# EAGLE design adc_guarded_newinput_autorouted (EAGLE 5.07)
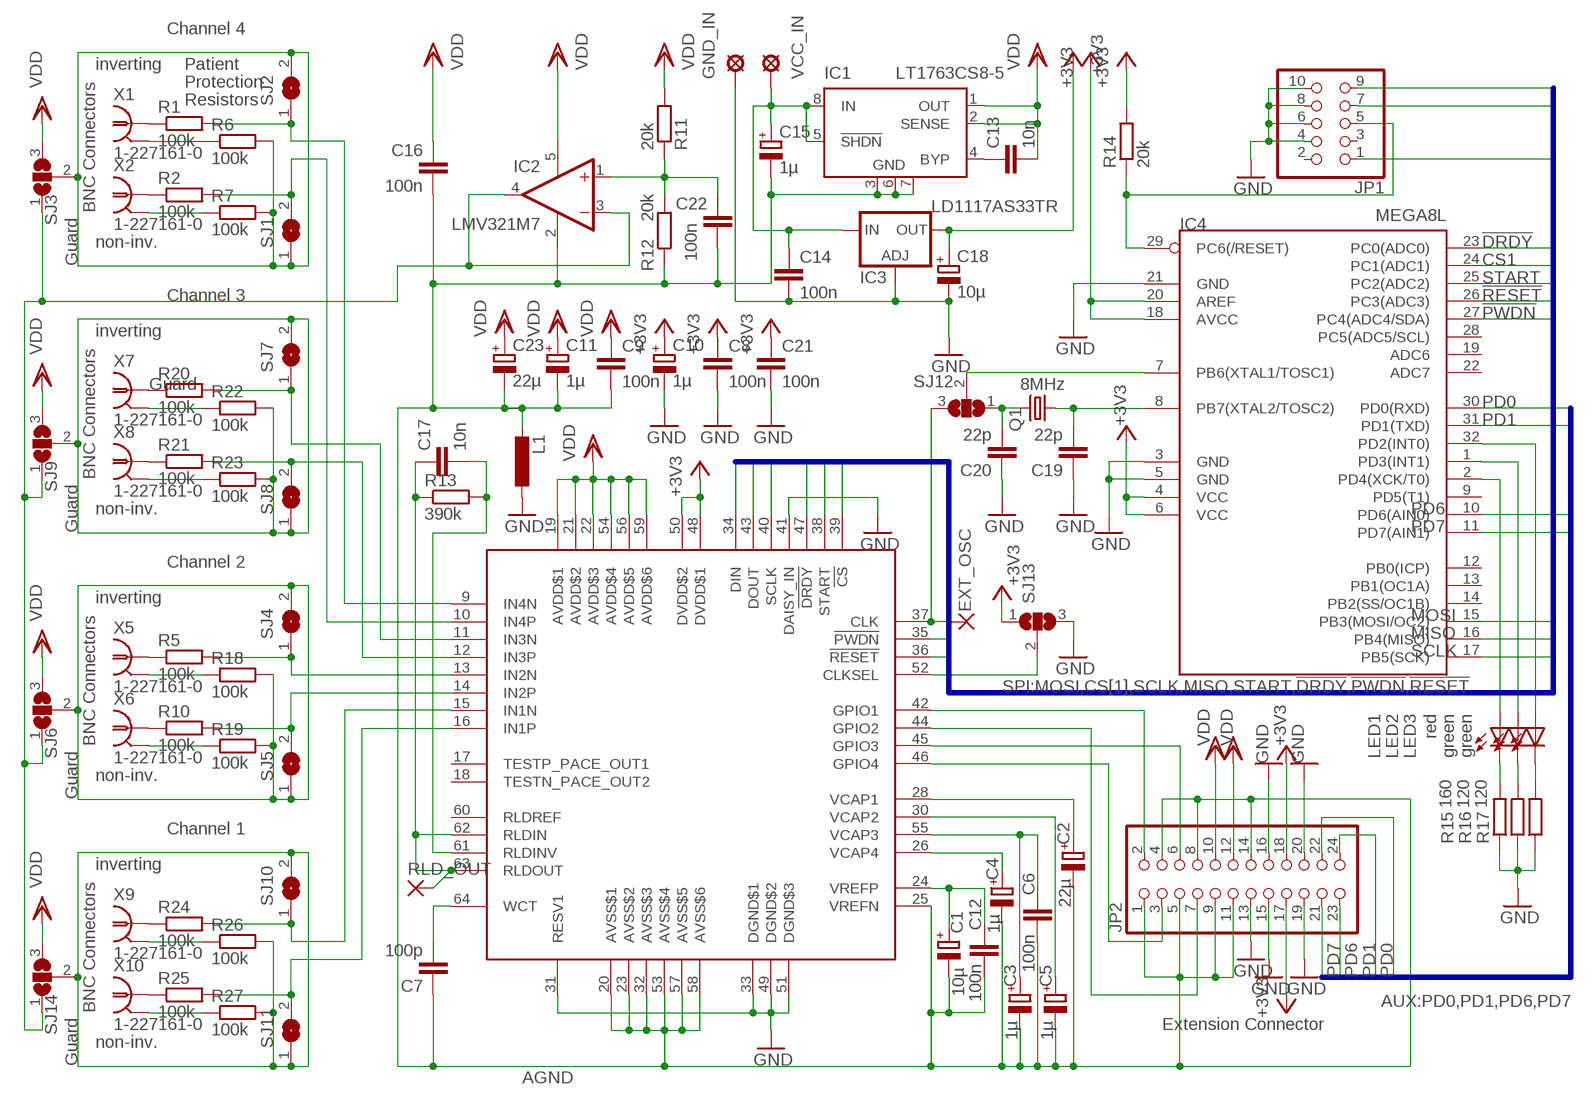
[diagram p0: schematic, sheet 1]

## Parts
C1  10µ  CPOL-EUSMCC  [SMC_C]
C2  22µ  CPOL-EUSMCD  [SMC_D]
C3  1µ  CPOL-EUSMCA  [SMC_A]
C4  1µ  CPOL-EUSMCA  [SMC_A]
C5  1µ  CPOL-EUSMCA  [SMC_A]
C6  100n  C-EUC1206  [C1206]
C7  100p  C-EUC1206  [C1206]
C8  100n  C-EUC1206  [C1206]
C9  100n  C-EUC1206  [C1206]
C10  1µ  CPOL-EUSMCA  [SMC_A]
C11  1µ  CPOL-EUSMCA  [SMC_A]
C12  100n  C-EUC1206  [C1206]
C13  10n  C-EUC1206  [C1206]
C14  100n  C-EUC1206  [C1206]
C15  1µ  CPOL-EUSMCA  [SMC_A]
C16  100n  C-EUC1206  [C1206]
C17  10n  C-EUC1206  [C1206]
C18  10µ  CPOL-EUSMCC  [SMC_C]
C19  22p  C-EUC1206  [C1206]
C20  22p  C-EUC1206  [C1206]
C21  100n  C-EUC1206  [C1206]
C22  100n  C-EUC1206  [C1206]
C23  22µ  CPOL-EUSMCD  [SMC_D]
EXT_OSC  1,6/0,8  [1,6/0,8]
GND_IN  MCS10B  [MCS10B]
IC1  LT1763CS8-5  LT1763CS8-3.3  [SOIC8]
IC2  LMV321M7  [SC70-5L]
IC3  LD1117AS33TR  LD117AS33TR  [SOT223]
IC4  MEGA8L  MEGA8-AI  [TQFP32-08]
JP1  PINHD-2X5  [2X05]
JP2  PINHD-2X12  [2X12]
L1  L-EUPIS2816  [PIS2816]
LED1  red  LEDCHIPLED_1206  [CHIPLED_1206]
LED2  green  LEDCHIPLED_1206  [CHIPLED_1206]
LED3  green  LEDCHIPLED_1206  [CHIPLED_1206]
Q1  8MHz  CRYSTALHC49UP  [HC49UP]
R1  100k  R-EU_R1206  [R1206]
R2  100k  R-EU_R1206  [R1206]
R5  100k  R-EU_R1206  [R1206]
R6  100k  R-EU_R1206  [R1206]
R7  100k  R-EU_R1206  [R1206]
R10  100k  R-EU_R1206  [R1206]
R11  20k  R-EU_R1206  [R1206]
R12  20k  R-EU_R1206  [R1206]
R13  390k  R-EU_R1206  [R1206]
R14  20k  R-EU_R1206  [R1206]
R15  160  R-EU_R1206  [R1206]
R16  120  R-EU_R1206  [R1206]
R17  120  R-EU_R1206  [R1206]
R18  100k  R-EU_R1206  [R1206]
R19  100k  R-EU_R1206  [R1206]
R20  100k  R-EU_R1206  [R1206]
R21  100k  R-EU_R1206  [R1206]
R22  100k  R-EU_R1206  [R1206]
R23  100k  R-EU_R1206  [R1206]
R24  100k  R-EU_R1206  [R1206]
R25  100k  R-EU_R1206  [R1206]
R26  100k  R-EU_R1206  [R1206]
R27  100k  R-EU_R1206  [R1206]
RLD_OUT  2,54/1,0  [2,54/1,0]
SJ1  SJW  [SJW]
SJ2  SJW  [SJW]
SJ3  SJ2WW  [SJ_2W]
SJ4  SJW  [SJW]
SJ5  SJW  [SJW]
SJ6  SJ2WW  [SJ_2W]
SJ7  SJW  [SJW]
SJ8  SJW  [SJW]
SJ9  SJ2WW  [SJ_2W]
SJ10  SJW  [SJW]
SJ11  SJW  [SJW]
SJ12  SJ2W  [SJ_2]
SJ13  SJ2W  [SJ_2]
SJ14  SJ2WW  [SJ_2W]
U$1  ADS1194  [TQFP-64]
VCC_IN  MCS10B  [MCS10B]
X1  1-227161-0  [AMP_227161]
X2  1-227161-0  [AMP_227161]
X5  1-227161-0  [AMP_227161]
X6  1-227161-0  [AMP_227161]
X7  1-227161-0  [AMP_227161]
X8  1-227161-0  [AMP_227161]
X9  1-227161-0  [AMP_227161]
X10  1-227161-0  [AMP_227161]

## Nets
!DRDY: IC4.23(PC0(ADC0)) U$1.47(!DRDY)
!PWDN: IC4.27(PC4(ADC4/SDA)) U$1.35(!PWDN)
!RESET: IC4.26(PC3(ADC3)) U$1.36(!RESET)
+3V3: C8.1 C10.+ C18.+ C21.1 IC3.4(OUT) IC4.4(VCC) IC4.6(VCC) IC4.18(AVCC) IC4.20(AREF) JP2.17 JP2.18 R14.2 SJ13.1 U$1.48(DVDD$1) U$1.50(DVDD$2)
CS1: IC4.24(PC1(ADC1)) U$1.39(!CS)
GND: C8.2 C10.- C14.2 C18.- C19.1 C20.1 C21.2 GND_IN.MP IC3.1(ADJ) IC4.3(GND) IC4.5(GND) IC4.21(GND) JP1.4 JP1.6 JP1.8 JP1.10 JP2.13 JP2.15 JP2.16 JP2.19 JP2.20 L1.1 R15.1 R16.1 R17.1 SJ13.3 U$1.31(RESV1) U$1.33(DGND$1) U$1.41(DAISY_IN) U$1.49(DGND$2) U$1.51(DGND$3)
MISO: IC4.16(PB4(MISO)) JP1.9 U$1.43(DOUT)
MOSI: IC4.15(PB3(MOSI/OC2)) JP1.1 U$1.34(DIN)
N$1: C2.+ U$1.28(VCAP1)
N$2: C4.+ U$1.26(VCAP4)
N$3: C7.2 U$1.64(WCT)
N$4: C5.+ U$1.30(VCAP2)
N$5: C3.+ C6.1 U$1.55(VCAP3)
N$6: C1.+ C12.1 U$1.24(VREFP)
N$7: C22.1 IC2.1(+IN) R11.1 R12.2
N$8: R6.2 R7.2 SJ1.1 SJ2.2 SJ3.2
N$9: JP2.6 U$1.45(GPIO3)
N$11: C14.1 C15.+ IC1.5(!SHDN) IC1.8(IN) IC3.3(IN) VCC_IN.MP
N$13: R2.2 SJ1.2 U$1.10(IN4P)
N$14: R5.1 X5.1
N$15: R10.1 X6.1
N$16: C13.1 IC1.4(BYP)
N$17: R1.1 X1.1
N$18: R2.1 X2.1
N$19: R10.2 SJ5.2 U$1.14(IN2P)
N$20: R1.2 SJ2.1 U$1.9(IN4N)
N$21: R19.1 X6.2(GND)
N$22: R18.1 X5.2(GND)
N$23: R20.1 X7.1
N$24: R18.2 R19.2 SJ4.2 SJ5.1 SJ6.2
N$25: R5.2 SJ4.1 U$1.13(IN2N)
N$26: C9.1 C11.+ C13.2 C16.1 C23.+ IC1.1(OUT) IC1.2(SENSE) IC2.5(V+) JP2.10 JP2.12 R11.2 SJ3.3 SJ6.3 SJ9.3 SJ14.3 U$1.19(AVDD$1) U$1.21(AVDD$2) U$1.22(AVDD$3) U$1.54(AVDD$4) U$1.56(AVDD$5) U$1.59(AVDD$6) ; supply symbol labelled VDD
N$27: R21.1 X8.1
N$30: R7.1 X2.2(GND)
N$31: R6.1 X1.2(GND)
N$33: C17.1 R13.1 RLD_OUT.1(P) U$1.62(RLDIN) U$1.63(RLDOUT)
N$34: C17.2 R13.2 U$1.61(RLDINV)
N$35: C20.2 Q1.2 SJ12.1
N$36: EXT_OSC.1(P) SJ12.3 U$1.37(CLK)
N$37: IC4.29(PC6(/RESET)) JP1.5 R14.1
N$38: C19.2 IC4.8(PB7(XTAL2/TOSC2)) Q1.1
N$39: SJ13.2 U$1.52(CLKSEL)
N$40: IC4.7(PB6(XTAL1/TOSC1)) SJ12.2
N$41: IC4.32(PD2(INT0)) LED3.A
N$42: IC4.1(PD3(INT1)) LED2.A
N$43: IC4.2(PD4(XCK/T0)) LED1.A
N$44: LED1.C R15.2
N$45: LED2.C R16.2
N$46: LED3.C R17.2
N$47: JP2.3 U$1.46(GPIO4)
N$49: JP2.2 U$1.42(GPIO1)
N$52: JP2.7 U$1.44(GPIO2)
N$58: R23.1 X8.2(GND)
N$59: R22.1 X7.2(GND)
N$60: R22.2 R23.2 SJ7.2 SJ8.1 SJ9.2
N$61: R20.2 SJ7.1 U$1.11(IN3N)
N$62: R21.2 SJ8.2 U$1.12(IN3P)
N$63: R24.1 X9.1
N$64: R25.1 X10.1
N$65: R27.1 X10.2(GND)
N$66: R26.1 X9.2(GND)
N$67: R26.2 R27.2 SJ10.2 SJ11.1 SJ14.2
N$68: R24.2 SJ10.1 U$1.15(IN1N)
N$69: R25.2 SJ11.2 U$1.16(IN1P)
N$70: IC2.3(-IN) IC2.4(OUT) SJ3.1 SJ6.1 SJ9.1 SJ14.1
PD0: IC4.30(PD0(RXD)) JP2.22
PD1: IC4.31(PD1(TXD)) JP2.24
PD6: IC4.10(PD6(AIN0)) JP2.23
PD7: IC4.11(PD7(AIN1)) JP2.21
SCLK: IC4.17(PB5(SCK)) JP1.7 U$1.40(SCLK)
START: IC4.25(PC2(ADC2)) U$1.38(START)
VSS: C1.- C2.- C3.- C4.- C5.- C6.2 C7.1 C9.2 C11.- C12.2 C15.- C16.2 C22.2 C23.- IC1.3(GND) IC1.6(GND) IC1.7(GND) IC2.2(V-) JP2.1 JP2.4 JP2.5 JP2.8 JP2.9 JP2.11 JP2.14 L1.2 R12.1 U$1.20(AVSS$1) U$1.23(AVSS$2) U$1.25(VREFN) U$1.32(AVSS$3) U$1.53(AVSS$4) U$1.57(AVSS$5) U$1.58(AVSS$6)
Unconnected: IC4.9(PD5(T1)) IC4.12(PB0(ICP)) IC4.13(PB1(OC1A)) IC4.14(PB2(SS/OC1B)) IC4.19(ADC6) IC4.22(ADC7) IC4.28(PC5(ADC5/SCL)) JP1.2 JP1.3 U$1.17(TESTP_PACE_OUT1) U$1.18(TESTN_PACE_OUT2) U$1.60(RLDREF)

## Buses
SPI:MOSI,CS[1],SCLK,MISO,START,!DRDY,!PWDN,!RESET
AUX:PD0,PD1,PD6,PD7

## Notes on the sheet
- Channel 4
- inverting | Patient
- Protection
- Resistors
- BNC Connectors
- non-inv.
- Guard
- Channel 3
- inverting
- Guard
- BNC Connectors
- non-inv.
- Guard
- Channel 2
- inverting
- BNC Connectors
- non-inv.
- Guard
- Channel 1
- inverting
- BNC Connectors
- Extension Connector
- non-inv.
- Guard
- AGND

## Library data of the parts
C1-C5 C10 C11 C15 C18 C23 = rcl:CPOL-EU: POLARIZED CAPACITOR, European symbol
C6-C9 C12-C14 C16 C17 C19-C22 = rcl:C-EU: CAPACITOR, European symbol
EXT_OSC = wirepad:1,6/0,8: THROUGH-HOLE PAD
GND_IN VCC_IN = solpad:MCS10B: SOLDER PAD MC S1, distributor Buerklin, 15F505
IC1 = linear-technology:LT1763CS8: 500mA, Low Noise, LDO Micropower Regulators Source: http://cds.linear.com/docs/Datasheet/1763ff.pdf
IC2 = linear:LMV321?*: General Purpose, Low Voltage, Rail-to-Rail Output Operational Amplifiers Source: http://www.national.com/mpf/LM/LMV321.html http://www.national.com/dt/lmv_qual.pdf
IC3 = v-reg:LD117A?*: Low drop fixed and adjustable positive voltage regulators 1 A Source: http://www.st.com/stonline/products/literature/ds/7194/ld1117axx.pdf
IC4 = atmel:MEGA8: MICROCONTROLLER 8 Kbytes FLASH, 1 kbytes SRAM, 512 bytes EEPROM, USART, 6-channel 10 bit ADC, 2-channel 8 bit ADC Pin compatible with Atmega48, ATMega88, ATMega168 Source: avr.lbr
JP1 = pinhead:PINHD-2X5: PIN HEADER
JP2 = pinhead:PINHD-2X12: PIN HEADER
L1 = rcl:L-EU: INDUCTOR, European symbol
LED1-LED3 = led:LED: LED OSRAM: - CHIPLED LG R971, LG N971, LY N971, LG Q971, LY Q971, LO R971, LY R971 LH N974, LH R974 LS Q976, LO Q976, LY Q976 LO Q996 - Hyper CHIPLED LW Q18S LB Q993, LB Q99A, LB R99A - SideLED LS A670, LO A670, LY A670, LG A670, LP A670 LB A673, LV A673, LT A673, LW A673 LH A674 LY A675 LS A676, LA A676, LO A676, LY A676, LW A676 LS A679, LY A679, LG A679 - Hyper Micro SIDELED® LS Y876, LA Y876, LO Y876, LY Y876 LT Y87S - SmartLED LW L88C, LW L88S LB L89C, LB L89S, LG L890 LS L89K, LO L89K, LY L89K LS L896, LA L896, LO L896, LY L896 - TOPLED LS T670, LO T670, LY T670, LG T670, LP T670 LSG T670, LSP T670, LSY T670, LOP T670, LYG T670 LG T671, LOG T671, LSG T671 LB T673, LV T673, LT T673, LW T673 LH T674 LS T676, LA T676, LO T676, LY T676, LB T676, LH T676, LSB T676, LW T676 LB T67C, LV T67C, LT T67C, LS T67K, LO T67K, LY T67K, LW E67C LS E67B, LA E67B, LO E67B, LY E67B, LB E67C, LV E67C, LT E67C LW T67C LS T679, LY T679, LG T679 LS T770, LO T770, LY T770, LG T770, LP T770 LB T773, LV T773, LT T773, LW T773 LH T774 LS E675, LA E675, LY E675, LS T675 LS T776, LA T776, LO T776, LY T776, LB T776 LHGB T686 LT T68C, LB T68C - Hyper Mini TOPLED® LB M676 - Mini TOPLED Santana® LG M470 LS M47K, LO M47K, LY M47K Source: http://www.osram.convergy.de LUXEON: - LUMILED® LXK2-PW12-R00, LXK2-PW12-S00, LXK2-PW14-U00, LXK2-PW14-V00 LXK2-PM12-R00, LXK2-PM12-S00, LXK2-PM14-U00 LXK2-PE12-Q00, LXK2-PE12-R00, LXK2-PE12-S00, LXK2-PE14-T00, LXK2-PE14-U00 LXK2-PB12-K00, LXK2-PB12-L00, LXK2-PB12-M00, LXK2-PB14-N00, LXK2-PB14-P00, LXK2-PB14-Q00 LXK2-PR12-L00, LXK2-PR12-M00, LXK2-PR14-Q00, LXK2-PR14-R00 LXK2-PD12-Q00, LXK2-PD12-R00, LXK2-PD12-S00 LXK2-PH12-R00, LXK2-PH12-S00 LXK2-PL12-P00, LXK2-PL12-Q00, LXK2-PL12-R00 Source: www.luxeon.com KINGBRIGHT: KA-3528ASYC Source: www.kingbright.com
Q1 = crystal:CRYSTAL: CRYSTAL
R1 R2 R5-R7 R10-R27 = rcl:R-EU_: RESISTOR, European symbol
RLD_OUT = wirepad:2,54/1,0: THROUGH-HOLE PAD
SJ1 SJ2 SJ4 SJ5 SJ7 SJ8 SJ10 SJ11 = jumper:SJ: SMD solder JUMPER
SJ3 SJ6 SJ9 SJ12-SJ14 = jumper:SJ2W: SMD solder JUMPER
U$1 = mytexas:ADS1194: Low-Power, 8-Channel, 16-Bit Analog Front-End for Biopotential Measurements for ECG/EEG applications
X1 X2 X5-X10 = con-coax:?227161*: JACK, RIGHT ANGLE, 50 OHM, PCB, BNC Source: amp_227161.pdf

## Board
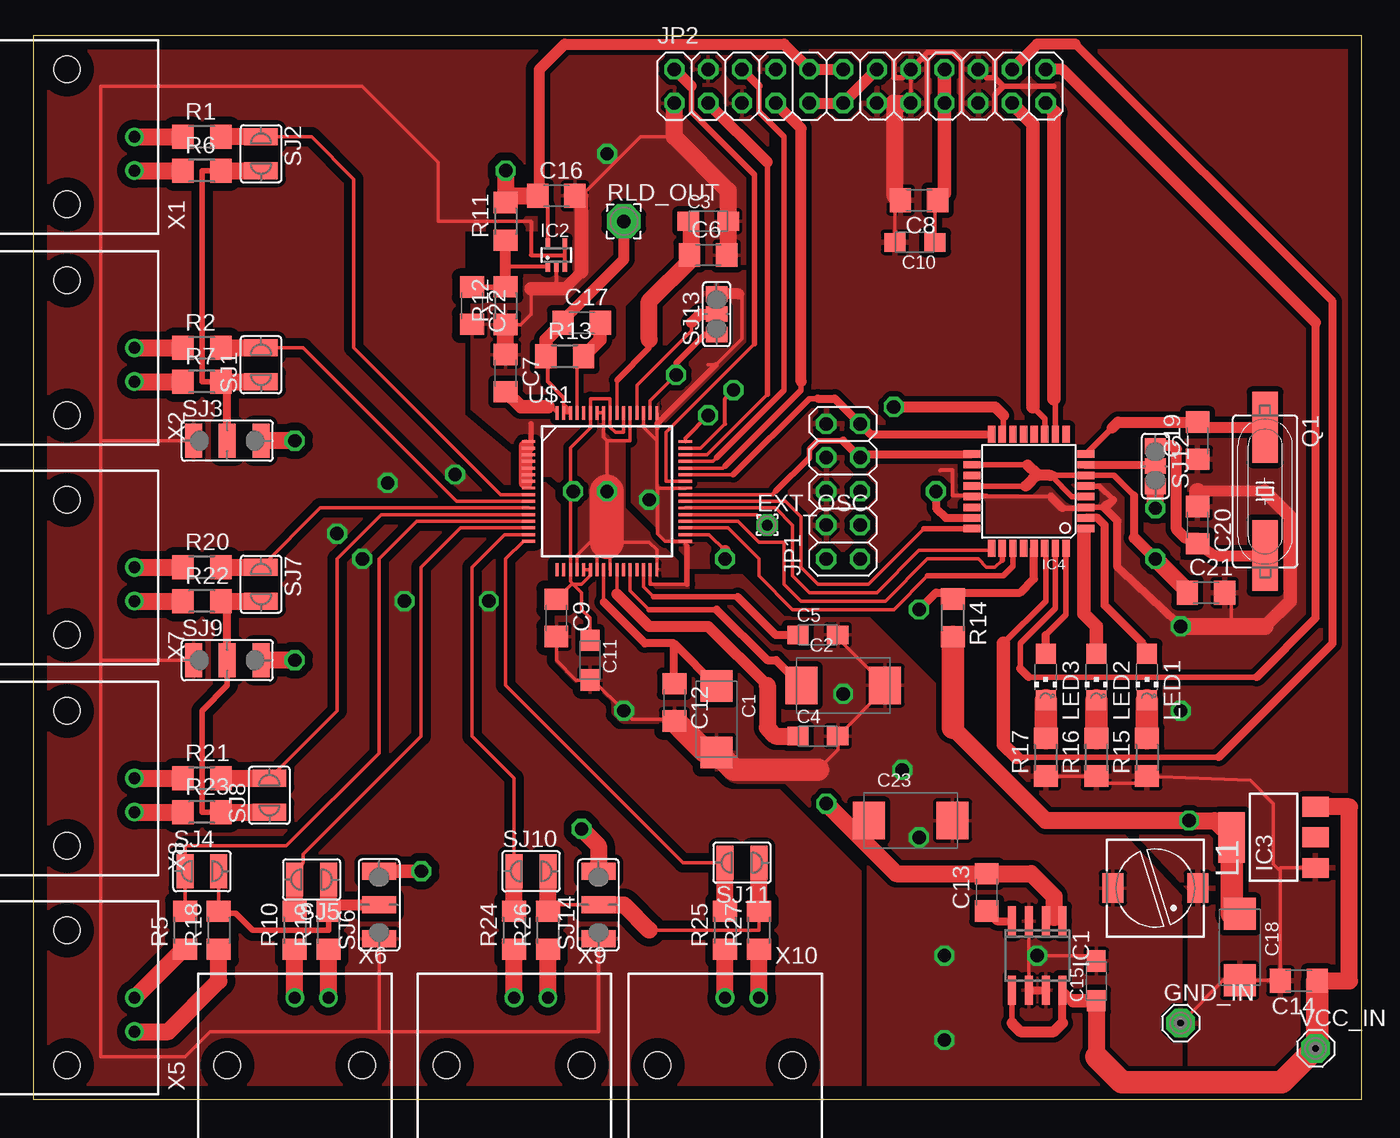
[diagram p1: board, top side]
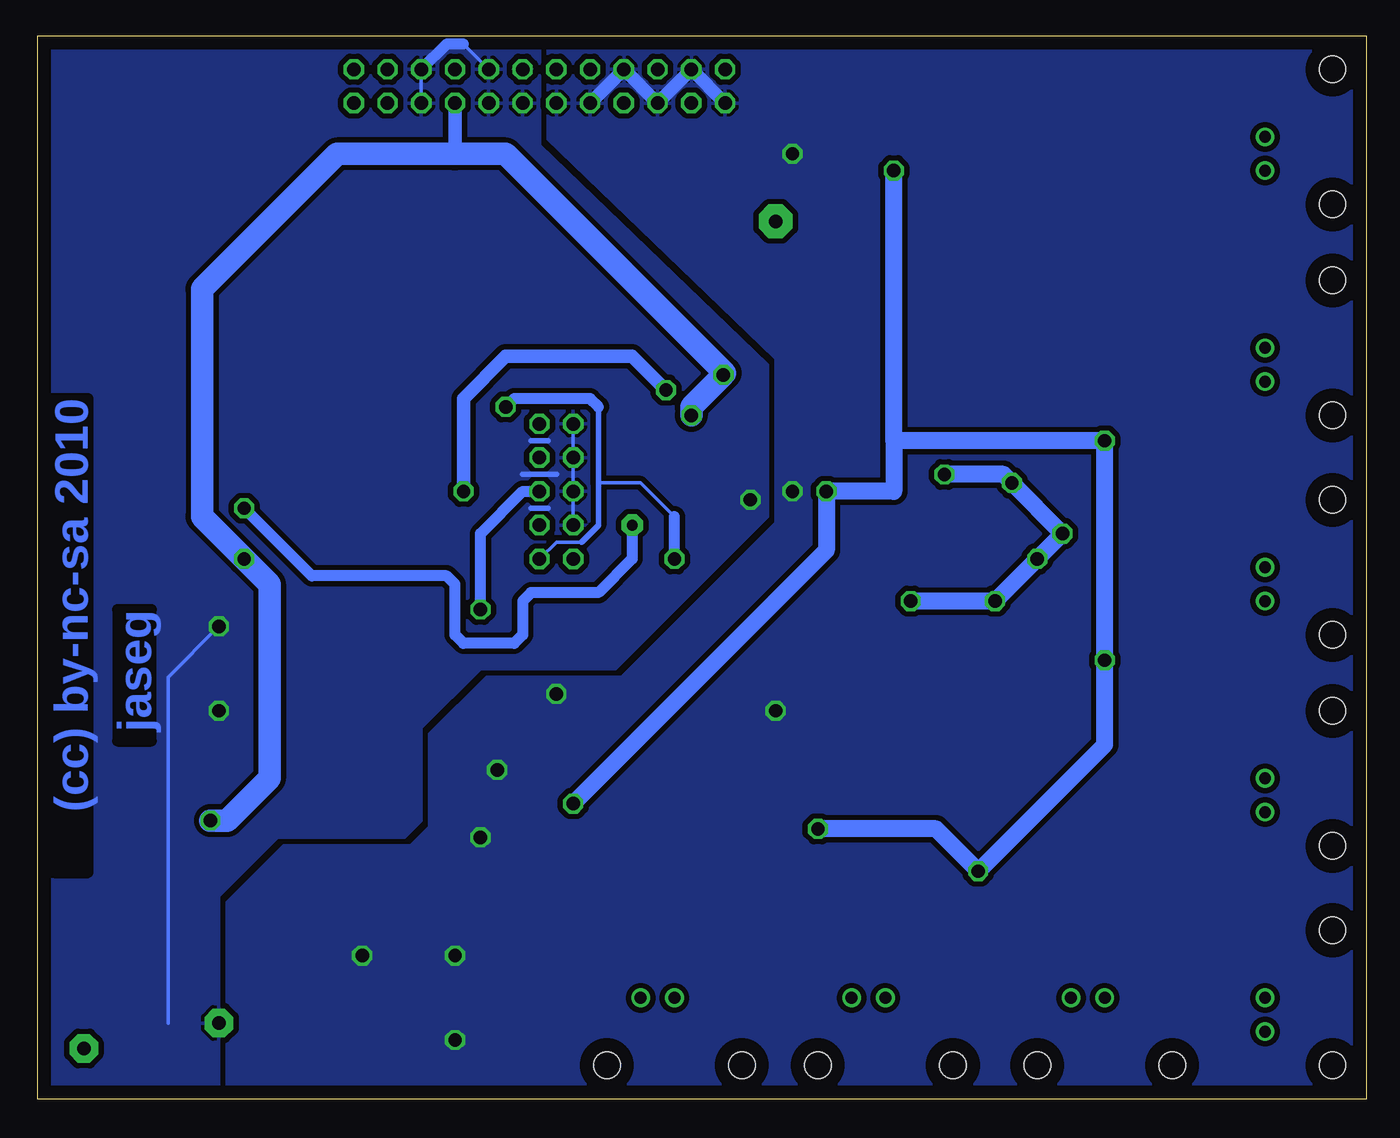
[diagram p2: board, bottom side, seen from below]

Size 100 x 80 mm. Coordinates in mm from the lower left corner, seen from the top.
Outline: 0,0 100,0 100,80 0,80 0,0
Copper layers (1*16): Top 0.035mm / dielectric 1.5mm / Bottom 0.035mm
Design rules "default *": minimum track width 0.22mm, minimum drill 24mil, track to track 8mil, track to pad 8mil, pad to pad 8mil, via to via 8mil, smd to smd 8mil, copper to edge 40mil, drill to drill 8mil, minimum pad ring 10mil, minimum via ring 8mil, stop-mask expansion 4mil, vias tented up to drill 0mil, thermal gap 10mil

### Footprints (pad centres in the part's own frame; a part is rotated, then mirrored left to right if it is on the bottom)
SMC_C = smd 2.4 x 2.4: + -2.5,0; - 2.5,0
SMC_D = smd 2.4 x 2.8: + -3.15,0; - 3.15,0
SMC_A = smd 1.6 x 1.4: + -1.5,0; - 1.5,0
C1206 = smd 1.6 x 1.8: 1 -1.4,0; 2 1.4,0
1,6/0,8 = drill 0.813 pad 1.6 octagon: 1 0,0
MCS10B = drill 1.016 pad 2.159 octagon: MP 0,0
SOIC8 = smd 0.6 x 2.2: 1 -1.905,-2.6; 2 -0.635,-2.6; 3 0.635,-2.6; 4 1.905,-2.6; 5 1.905,2.6; 6 0.635,2.6; 7 -0.635,2.6; 8 -1.905,2.6
SC70-5L = smd 0.35 x 0.8: 1 -0.65,-0.85; 2 0,-0.85; 3 0.65,-0.85; 4 0.65,0.85; 5 -0.65,0.85
SOT223 = smd 1.5 x 2: 1 -2.3,-3.15; 2 0,-3.15; 3 2.3,-3.15 | smd 3.8 x 2: 4 0,3.15
TQFP32-08 = smd 1.27 x 0.559: 1 -4.293,2.8; 2 -4.293,2; 3 -4.293,1.2; 4 -4.293,0.4; 5 -4.293,-0.4; 6 -4.293,-1.2; 7 -4.293,-2; 8 -4.293,-2.8; 17 4.293,-2.8; 18 4.293,-2; 19 4.293,-1.2; 20 4.293,-0.4; 21 4.293,0.4; 22 4.293,1.2; 23 4.293,2; 24 4.293,2.8 | smd 0.559 x 1.27: 9 -2.8,-4.293; 10 -2,-4.293; 11 -1.2,-4.293; 12 -0.4,-4.293; 13 0.4,-4.293; 14 1.2,-4.293; 15 2,-4.293; 16 2.8,-4.293; 25 2.8,4.293; 26 2,4.293; 27 1.2,4.293; 28 0.4,4.293; 29 -0.4,4.293; 30 -1.2,4.293; 31 -2,4.293; 32 -2.8,4.293
2X05 = drill 1.016 octagon: 1 -5.08,-1.27; 2 -5.08,1.27; 3 -2.54,-1.27; 4 -2.54,1.27; 5 0,-1.27; 6 0,1.27; 7 2.54,-1.27; 8 2.54,1.27; 9 5.08,-1.27; 10 5.08,1.27
2X12 = drill 1.016 octagon: 1 -13.97,-1.27; 2 -13.97,1.27; 3 -11.43,-1.27; 4 -11.43,1.27; 5 -8.89,-1.27; 6 -8.89,1.27; 7 -6.35,-1.27; 8 -6.35,1.27; 9 -3.81,-1.27; 10 -3.81,1.27; 11 -1.27,-1.27; 12 -1.27,1.27; 13 1.27,-1.27; 14 1.27,1.27; 15 3.81,-1.27; 16 3.81,1.27; 17 6.35,-1.27; 18 6.35,1.27; 19 8.89,-1.27; 20 8.89,1.27; 21 11.43,-1.27; 22 11.43,1.27; 23 13.97,-1.27; 24 13.97,1.27
PIS2816 = smd 2.2 x 1.6: 1 0,3.2; 2 0,-3.2
CHIPLED_1206 = smd 1.5 x 1.5: A 0,-1.75; C 0,1.75
HC49UP = smd 5.334 x 1.93: 1 -4.826,0; 2 4.826,0
R1206 = smd 1.6 x 1.803: 1 -1.422,0; 2 1.422,0
2,54/1,0 = drill 1.016 pad 2.54 octagon: 1 0,0
SJW = smd 1.27 x 2.54: 1 -1.27,0; 2 1.27,0
SJ_2W = smd 1.27 x 2.54: 1 -2.54,0; 2 0,0; 3 2.54,0
SJ_2 = smd 1.168 x 1.6: 1 -1.524,0; 2 0,0; 3 1.524,0
TQFP-64 = smd 1 x 0.22: 1 -5.9,3.75; 2 -5.9,3.25; 3 -5.9,2.75; 4 -5.9,2.25; 5 -5.9,1.75; 6 -5.9,1.25; 7 -5.9,0.75; 8 -5.9,0.25; 9 -5.9,-0.25; 10 -5.9,-0.75; 11 -5.9,-1.25; 12 -5.9,-1.75; 13 -5.9,-2.25; 14 -5.9,-2.75; 15 -5.9,-3.25; 16 -5.9,-3.75; 33 5.9,-3.75; 34 5.9,-3.25; 35 5.9,-2.75; 36 5.9,-2.25; 37 5.9,-1.75; 38 5.9,-1.25; 39 5.9,-0.75; 40 5.9,-0.25; 41 5.9,0.25; 42 5.9,0.75; 43 5.9,1.25; 44 5.9,1.75; 45 5.9,2.25; 46 5.9,2.75; 47 5.9,3.25; 48 5.9,3.75 | smd 0.22 x 1: 17 -3.75,-5.9; 18 -3.25,-5.9; 19 -2.75,-5.9; 20 -2.25,-5.9; 21 -1.75,-5.9; 22 -1.25,-5.9; 23 -0.75,-5.9; 24 -0.25,-5.9; 25 0.25,-5.9; 26 0.75,-5.9; 27 1.25,-5.9; 28 1.75,-5.9; 29 2.25,-5.9; 30 2.75,-5.9; 31 3.25,-5.9; 32 3.75,-5.9; 49 3.75,5.9; 50 3.25,5.9; 51 2.75,5.9; 52 2.25,5.9; 53 1.75,5.9; 54 1.25,5.9; 55 0.75,5.9; 56 0.25,5.9; 57 -0.25,5.9; 58 -0.75,5.9; 59 -1.25,5.9; 60 -1.75,5.9; 61 -2.25,5.9; 62 -2.75,5.9; 63 -3.25,5.9; 64 -3.75,5.9
AMP_227161 = drill 0.9 pad 1.27 round: 1 0,-5.08; 2 -2.54,-5.08 | hole 2: -5.08,0; 5.08,0

### Placement (x,y rotation side)
C1  51.44,28.57 270 top
C2  60.96,31.11 0 top
C3  50.8,66.04 0 top
C4  59.05,27.3 0 top
C5  59.05,34.92 0 top
C6  50.8,63.5 0 top
C7  35.56,54.61 270 top
C8  66.67,67.63 180 top
C9  39.37,36.2 270 top
C10  66.36,64.45 180 top
C11  41.91,33.02 270 top
C12  48.26,29.84 270 top
C13  71.75,15.56 90 top
C14  95.25,8.89 180 top
C15  80.01,8.89 90 top
C16  39.37,67.94 0 top
C17  41.27,58.42 0 top
C18  90.81,11.43 270 top
C19  87.63,49.53 90 top
C20  87.63,43.18 270 top
C21  88.27,38.1 0 top
C22  33.02,59.69 270 top
C23  66.04,20.95 0 top
EXT_OSC  55.24,43.18 0 top
GND_IN  86.36,5.71 0 top
IC1  75.56,10.79 180 top
IC2  39.37,63.5 0 top
IC3  93.34,19.68 90 top
IC4  74.93,45.72 180 top
JP1  60.96,45.72 90 top
JP2  62.23,76.2 0 top
L1  84.45,15.88 270 top
LED1  83.82,31.75 180 top
LED2  80.01,31.75 180 top
LED3  76.2,31.75 180 top
Q1  92.71,45.72 270 top
R1  12.7,72.39 0 top
R2  12.7,56.52 0 top
R5  11.43,12.7 90 top
R6  12.7,69.85 0 top
R7  12.7,53.98 0 top
R10  19.68,12.7 90 top
R11  35.56,66.04 90 top
R12  35.56,59.69 90 top
R13  40.01,55.88 0 top
R14  69.22,36.2 270 top
R15  83.82,25.72 90 top
R16  80.01,25.72 90 top
R17  76.2,25.72 90 top
R18  13.97,12.7 90 top
R19  22.23,12.7 90 top
R20  12.7,40.01 0 top
R21  12.7,24.13 0 top
R22  12.7,37.47 0 top
R23  12.7,21.59 0 top
R24  36.2,12.7 90 top
R25  52.07,12.7 90 top
R26  38.73,12.7 90 top
R27  54.61,12.7 90 top
RLD_OUT  44.45,66.04 0 top
SJ1  17.14,55.24 90 top
SJ2  17.14,71.12 270 top
SJ3  14.61,49.53 0 top
SJ4  12.7,17.14 0 top
SJ5  20.95,16.51 180 top
SJ6  26.04,14.61 90 top
SJ7  17.14,38.73 270 top
SJ8  17.78,22.86 90 top
SJ9  14.61,33.02 0 top
SJ10  37.47,17.14 0 top
SJ11  53.34,17.78 180 top
SJ12  84.45,47.62 270 top
SJ13  51.44,59.05 90 top
SJ14  42.55,14.61 90 top
U$1  43.18,45.72 0 top
VCC_IN  96.52,3.81 0 top
X1  2.54,72.39 90 top
X2  2.54,56.52 90 top
X5  2.54,7.62 90 top
X6  19.68,2.54 180 top
X7  2.54,40.01 90 top
X8  2.54,24.13 90 top
X9  36.2,2.54 180 top
X10  52.07,2.54 180 top

### Tracks (layer width: path | path; a pad name or v marks a point on that pad's centre or on a via)
!DRDY  (via drill 1)
  Top 0.254: U$1.47 50.24,48.97 52.07,50.8
  Top 0.305: 52.07,50.8 52.07,52.7 v52.7,53.34
  Top 0.61: v67.94,45.72 67.94,44.45 68.67,43.72 IC4.23
  Bottom 1.016: v52.7,53.34 55.24,55.88 64.77,55.88 67.94,52.7 v67.94,45.72
!PWDN
  Top 0.254: U$1.35 52.28,42.97 54.61,40.64 54.61,39.37 57.15,36.83 64.77,36.83 67.31,39.37
  Top 0.406: 67.31,39.37 73.03,39.37 73.73,40.08 IC4.27
!RESET
  Top 0.254: U$1.36 53.05,43.47 54.61,41.91 56.52,41.91 56.52,38.73 57.78,37.47 64.14,37.47 67.31,40.64 71.12,40.64 71.75,40.01 72.39,40.01 72.93,40.55
  Top 0.406: 72.93,40.55 IC4.26
+3V3  (via drill 1)
  Top 0.254: U$1.50 46.43,52.53 v48.39,54.48 | 49.08,49.72 U$1.48 | C10.+ 67.86,67.41 C8.1 68.58,68.13 | 75.64,46.92 75.56,46.99 | 86.86,38.23 C21.1 84.45,40.51 v84.45,40.64
  Top 0.305: v50.8,51.44 49.08,49.72
  Top 0.406: 76.83,46.92 IC4.6 81.35,46.92 82.87,45.4 | 78.44,45.32 IC4.4 78.19,45.32 76.59,46.92 | 74.83,47.72 IC4.18 | 74.69,46.12 IC4.20 | v48.39,54.48 48.39,55.37 50.55,57.53 SJ13.1
  Top 0.61: 76.83,46.92 76.52,46.92 | 82.87,42.23 82.87,45.4
  Top 0.813: 75.64,46.92 76.52,46.92 76.59,46.92 | 74.83,47.72 75.56,46.99 74.69,46.12 | v84.45,40.64 82.87,42.23
  Top 1.016: 68.58,68.13 JP2.17 JP2.18
  Top 1.27: v84.45,40.64 86.86,38.23 | 69.22,27.94 76.2,20.95 v87,20.95 88.92,20.95 IC3.4
  Top 1.676: 69.22,27.94 R14.2 | C18.+ 90.19,13.93 IC3.4
  Bottom 0.254: v48.39,54.48 48.26,54.61
  Bottom 1.016: 68.58,71.12 JP2.17
  Bottom 1.676: v50.8,51.44 50.8,52.07 v48.39,54.48 | v87,20.95 85.72,20.95 82.55,24.13 82.55,38.73 v84.45,40.64 87.63,43.81 87.63,60.96 77.47,71.12 68.58,71.12 64.77,71.12 48.26,54.61
CS1
  Top 0.254: U$1.39 56.63,44.97 57.78,43.81 57.78,40.01 59.05,38.73 62.87,38.73 67.05,42.92
  Top 0.406: 67.05,42.92 IC4.24
GND  (via drill 1)
  Top 0.254: IC4.3 79.15,44.45 | R17.1 R16.1 80.24,23.75 83.59,23.75 R15.1 | R15.1 83.5,23.98 | 64.77,74.93 JP2.13 | JP2.15 JP2.16 | U$1.31 46.43,38.73 49.21,38.73 | 49.21,41.59 49.08,41.73 U$1.33 47.56,41.97 46.99,42.55 46.99,45.97 | GND_IN.MP 89.58,8.93 C18.- 93.81,8.93 C14.2 93.85,17.14 | IC3.1 93.85,17.39 93.85,17.14 | 46.93,49.53 46.93,45.97 46.99,45.97 | 46.93,49.53 46.93,50.8 U$1.49 | 46.99,45.97 U$1.41 | C10.- 64.86,66.76 65.41,67.31 65.41,67.5 C8.2 | 53.09,60.58 53.34,60.33 53.34,57.21 51.38,55.24 50.8,55.24 | U$1.51 45.93,50.53 46.93,49.53 | C21.2 90.17,37.59 90.17,35.56 | R15.1 91.59,23.98 93.34,22.23 93.34,17.65 93.85,17.14 | 71.75,45.4 70.72,45.4 IC4.21
  Top 0.305: 76.6,45.32 IC4.21 | 71.75,45.4 69.22,45.4 69.22,47.31 68.26,47.31
  Top 0.406: IC4.3 80.58,44.52 80.72,44.52 | IC4.5 80.25,46.12 81.28,45.09 | 89.53,35.56 89.22,35.88 | 79.15,44.45 77.47,44.45 | 46.93,50.8 51.38,55.24 | 64.77,78.11 64.77,76.83 65.41,76.83 JP2.16 66.99,78.42 | 72.39,76.83 72.39,78.11 | 72.39,74.3 72.39,75.56 73.03,76.2 | 73.03,76.2 76.83,76.2 | 72.39,76.83 73.03,76.2 | 72.39,76.83 71.75,76.83 JP2.20 | 69.85,74.3 69.85,78.11 69.22,78.74 67.31,78.74 66.99,78.42 | 67.31,74.3 67.31,78.11 66.99,78.42 | 49.21,38.73 49.21,41.59
  Top 0.61: 80.72,44.52 80.96,44.77 | 80.96,44.77 81.28,45.09 | v86.36,35.56 81.6,40.01 81.6,43.5 80.58,44.52 80.82,44.77 80.96,44.77 | 77.47,44.45 76.6,45.32
  Top 0.813: 64.86,74.84 64.77,74.93 | 65.17,67.63 64.86,67.94 | 92.71,45.72 87.63,45.72 | 53.09,60.58 SJ13.3
  Top 1.016: 92.71,35.56 94.61,37.47 94.61,43.81 92.71,45.72
  Top 1.27: 64.77,74.93 JP2.15 | 64.86,67.94 64.86,74.84 | v86.36,35.56 89.53,35.56 90.17,35.56 92.71,35.56 | 87.63,45.72 C20.1
  Bottom 0.254: JP1.10 JP1.8 JP1.6 JP1.4 | v86.36,35.56 90.17,31.75 90.17,5.71 | JP2.20 JP2.19 | JP2.16 67.94,79.38
  Bottom 0.406: 61.59,49.53 62.87,49.53 | 60.96,46.99 63.5,46.99 | 61.59,44.45 62.87,44.45
  Bottom 0.813: 67.94,79.38 69.22,79.38 JP2.20
  other vias: 86.36,29.21 46.35,45.09
  pour Bottom (isolate 0.406): 99.69,80.01 62.23,80.01 62.23,71.75 45.09,55.24 45.09,43.81 56.52,32.38 66.67,32.38 71.12,27.94 71.12,20.95 72.39,19.68 81.92,19.68 86.36,15.24 86.36,0 99.69,0
  pour Top (isolate 0.406, rank 3): 100.33,80.01 38.73,80.01 38.73,0 100.33,0
MISO
  Top 0.254: U$1.43 52.69,46.97
  Top 0.406: 59.05,52.7 58.42,52.7 52.69,46.97
  Top 0.61: 59.05,52.7 60.33,52.7 JP1.9 63.02,50.01 IC4.16
MOSI  (via drill 1)
  Top 0.254: 73.03,50.11 IC4.15 | U$1.34 50.88,42.47 52.07,41.27
  Top 0.406: 73.03,51.44 73.03,50.11
  Top 0.813: 73.03,51.44 72.39,52.07 v64.77,52.07 | 52.07,41.27 v52.07,40.64
  Bottom 0.254: 59.05,41.91 60.96,41.91 JP1.1 | 52.07,43.81 54.61,46.35 57.78,46.35
  Bottom 0.406: 59.05,41.91 57.78,43.18 57.78,46.35 57.78,52.07
  Bottom 0.813: 57.78,52.07 58.42,52.7 64.14,52.7 v64.77,52.07 | v52.07,40.64 52.07,43.81
N$1
  Top 0.254: U$1.28 44.93,38.26 46.35,36.83
  Top 0.406: 46.35,36.83 51.44,36.83
  Top 0.61: 51.44,36.83 55.24,33.02 55.91,33.02 C2.+
N$2
  Top 0.254: 43.93,37.98 U$1.26
  Top 0.813: 43.93,37.98 46.35,35.56 50.8,35.56 55.24,31.11
  Top 1.27: 55.24,31.11 55.24,27.94 55.88,27.3 C4.+
N$3
  Top 0.254: 39.43,51.69 U$1.64 38.98,52.07 38.73,52.07
  Top 1.016: C7.2 36.7,52.07 38.73,52.07
N$4
  Top 0.254: U$1.30 45.93,38.52 46.67,37.78
  Top 0.406: 46.67,37.78 53.02,37.78
  Top 0.61: 53.02,37.78 55.88,34.92 C5.+
N$5
  Top 0.254: C6.1 49.53,63.5 | U$1.55 43.93,54.09
  Top 0.305: 49.53,65.81 C3.+
  Top 0.406: 43.93,54.09 46.35,56.52 46.35,57.15
  Top 1.27: C6.1 49.53,63.18 46.35,60.01 46.35,57.15 | 49.53,63.5 49.53,65.81
N$6
  Top 0.254: 42.93,37.4 U$1.24 | 48.22,31.29 C12.1
  Top 0.61: 42.93,37.4 46.04,34.29 48.22,34.29 | 48.22,34.29 C1.+ | 48.22,31.29 48.22,34.29
N$7
  Top 0.305: 35.56,62.65 IC2.1
  Top 0.406: C22.1 35.56,61.09 R12.2
  Top 0.813: R11.1 35.56,62.65 R12.2
N$8
  Top 0.254: 14.61,53.49 R7.2
  Top 0.406: 13.97,53.98 R7.2 12.7,53.98 12.7,69.85 R6.2
  Top 0.61: SJ3.2 14.61,53.49
  Top 1.27: R6.2 SJ2.2 | R7.2 SJ1.1
N$9
  Top 0.254: U$1.45 51.15,47.97 51.44,48.26
  Top 0.406: 51.44,48.26 56.52,53.34 56.52,72.39 54.61,74.3 54.61,76.2
  Top 0.61: 54.61,76.2 JP2.6
N$11
  Top 0.254: VCC_IN.MP 96.65,3.94
  Top 0.406: 73.66,5.71 IC1.5
  Top 0.61: 78.28,7.39 IC1.8 77.47,5.71
  Top 0.813: 77.47,5.71 76.83,5.08 74.3,5.08 73.66,5.71
  Top 1.016: 78.28,7.39 C15.+
  Top 1.27: C15.+ 80.01,3.17 | IC3.3 99.06,21.98 99.06,8.89 C14.1
  Top 1.676: 96.65,3.94 C14.1 | 80.01,3.17 81.92,1.27 93.98,1.27 VCC_IN.MP
N$13
  Top 0.254: U$1.10 31.86,44.97 20.32,56.52 SJ1.2
  Top 1.27: R2.2 SJ1.2
N$14
  Top 0.254: 11.28,11.28 R5.1
  Top 1.27: X5.1 11.28,11.28
N$15
  Top 1.27: X6.1 R10.1
N$16
  Top 0.61: IC1.4 72.52,13.39 C13.1
N$17
  Top 1.27: X1.1 R1.1
N$18
  Top 1.27: X2.1 R2.1
N$19
  Top 0.254: SJ5.2 20.32,17.78 20.32,18.41 29.21,27.3 29.21,40.01 32.17,42.97 U$1.14
  Top 1.27: R10.2 SJ5.2
N$20
  Top 0.254: U$1.9 35.17,45.47 24.13,56.52 24.13,69.22 20.95,72.39 SJ2.1
  Top 1.27: SJ2.1 R1.2
N$21
  Top 1.27: X6.2 R19.1
N$22
  Top 1.27: X5.2 10.16,5.08 13.97,8.89 R18.1
N$23
  Top 1.27: X7.1 R20.1
N$24
  Top 0.254: SJ4.2 R18.2 14.12,13.97 | R19.2 22.71,14.61
  Top 0.406: 14.12,13.97 15.24,13.97 16.51,12.7 22.23,12.7 R19.2
  Top 0.813: 22.71,14.61 SJ6.2
  Top 1.27: R19.2 SJ5.1
N$25
  Top 0.254: R5.2 SJ4.1 11.43,19.05 19.05,19.05 26.04,26.04 26.04,40.64 28.86,43.47 U$1.13
N$26  (via drill 1)
  Top 0: U$1.59 41.91,51.6
  Top 0.254: 38.72,67.19 C16.1 38.1,68.08 | U$1.54 44.43,50.16 43.81,50.16 43.43,50.55 U$1.56 43.43,52.7 41.93,52.7 U$1.59 41.93,50.5 40.43,49 40.43,45.72 | 40.43,45.72 U$1.19 40.43,38.95 40.64,38.73 | v40.64,45.72 40.43,45.72 | 76.83,13.65 76.46,13.65 IC1.2 | 40.64,38.73 41.27,38.73 41.91,39.37 41.91,39.8 U$1.22 U$1.21 | 40.64,38.73 40.51,38.73 C9.1 | C11.+ 41.91,36.2 41.27,36.83 41.27,38.1 40.64,38.73 | C23.+ 61.94,20 61.91,20
  Top 0.305: 38.72,67.19 IC2.5
  Top 0.61: IC1.2 IC1.1
  Top 0.813: JP2.12 JP2.10 56.52,79.38 40.01,79.38 38.1,77.47 38.1,68.08
  Top 1.016: SJ6.3 v29.21,17.14
  Top 1.27: v19.68,49.53 SJ3.3 | v19.68,33.02 SJ9.3 | v41.27,20.32 42.55,19.05 SJ14.3 | v59.69,22.23 61.91,20 64.96,16.96 C13.2 75.12,16.96 76.83,15.24 76.83,13.65 | 35.56,67.94 C16.1 | v35.56,69.85 35.56,67.94 | 35.56,67.94 R11.2
  Bottom 1.27: 35.56,49.53 35.56,45.72 v40.64,45.72 40.64,41.27 v59.69,22.23 | v41.27,20.32 32.38,20.32 v29.21,17.14 19.68,26.67 v19.68,33.02 v19.68,49.53 35.56,49.53 | 35.56,49.53 v35.56,69.85
N$27
  Top 1.27: X8.1 R21.1
N$30
  Top 1.27: X2.2 R7.1
N$31
  Top 1.27: X1.2 R6.1
N$33
  Top 0.254: U$1.62 U$1.63 39.93,52.78
  Top 0.305: 39.93,52.78 38.73,53.98 38.73,55.73 R13.1
  Top 0.813: RLD_OUT.1 44.45,63.18 39.88,58.61
  Top 1.016: R13.1 38.58,57.13 C17.1 39.88,58.61
N$34
  Top 0.254: U$1.61 40.93,55.38
  Top 0.305: 40.93,55.38 R13.2
  Top 1.016: R13.2 42.67,57.13 C17.2
N$35
  Top 0.813: Q1.2 88.97,40.89 C20.2 87.63,42.23 86.68,42.23 86.04,42.86 86.04,48.9 85.79,49.15 SJ12.1
N$36  (via drill 1)
  Top 0.254: U$1.37 54.45,43.97 EXT_OSC.1
  Top 1.27: v84.45,44.45 SJ12.3
  Bottom 0.813: EXT_OSC.1 55.24,40.64 57.78,38.1 62.87,38.1 63.5,37.47 63.5,34.92 64.14,34.29 67.94,34.29 68.58,34.92 68.58,38.73 69.22,39.37 79.38,39.37 v84.45,44.45
N$37  (via drill 1)
  Top 0.254: 68.73,38.1 R14.1 69.7,38.1
  Top 0.61: IC4.29 75.33,39.13 74.3,38.1 69.7,38.1 | 68.73,38.1 67.94,38.1 v66.67,36.83
  Bottom 0.813: JP1.5 63.5,45.72 66.67,42.55 v66.67,36.83
N$38
  Top 0.254: C19.2 87.7,50.55
  Top 0.406: IC4.8 81.18,50.48
  Top 0.813: 87.7,50.55 Q1.1 | 81.18,50.48 81.63,50.93 C19.2
N$39
  Top 0.254: U$1.52 45.43,53.69 49.53,57.78 49.53,58.42
  Top 0.813: 49.53,58.42 50.16,59.05 SJ13.2
N$40
  Top 0.406: 84.36,47.72 SJ12.2
  Top 0.61: IC4.7 84.36,47.72
N$41
  Top 0.406: IC4.32 77.73,36.45 76.2,34.92
  Top 0.61: LED3.A 76.2,34.92
N$42
  Top 0.254: 79.22,36.35 IC4.1
  Top 1.016: 79.22,36.35 80.01,35.56 LED2.A
N$43
  Top 0.61: IC4.2 80.11,43.72 80.64,43.18 80.64,37.15 83.5,34.29 83.5,33.82 LED1.A
N$44
  Top 1.676: R15.2 LED1.C
N$45
  Top 1.676: R16.2 LED2.C
N$46
  Top 1.676: R17.2 LED3.C
N$47
  Top 0.254: U$1.46 50.69,48.47 55.24,53.02
  Top 0.406: 55.24,53.02 55.24,70.48
  Top 0.813: 55.24,70.48 JP2.3
N$48
  Top 1.016: 79.06,36.51 79.06,42.55
N$49
  Top 0.254: U$1.42 47.62,46.47 47.62,50.16 54.29,56.83
  Top 0.406: 49.53,76.2 49.53,74.3 54.29,69.53 54.29,56.83
  Top 0.813: 49.53,76.2 JP2.2
N$52
  Top 0.254: 52.07,47.62 51.91,47.47 U$1.44
  Top 0.406: 57.78,53.98 57.78,53.34 52.07,47.62
  Top 0.813: JP2.7 57.78,73.03 57.78,53.98
N$55
  Top 0.406: 40.01,52.07 40.32,51.75
N$56
  Top 1.016: 37.07,46.38 37.06,49.1
N$58
  Top 1.27: X8.2 R23.1
N$59
  Top 1.27: X7.2 R22.1
N$60
  Top 0.254: 14.61,36.98 R22.2
  Top 0.406: R23.2 12.7,21.59 12.7,29.21 14.61,31.11 SJ9.2
  Top 0.61: SJ9.2 14.61,36.98
  Top 1.27: R22.2 SJ7.2 | R23.2 SJ8.1
N$61
  Top 0.254: U$1.11 21.61,44.47 SJ7.1
  Top 1.27: R20.2 SJ7.1
N$62
  Top 0.254: U$1.12 26.19,43.97 22.86,40.64 22.86,29.21 SJ8.2
  Top 1.27: R21.2 SJ8.2
N$63
  Top 1.27: X9.1 R24.1
N$64
  Top 1.27: X10.1 R25.1
N$65
  Top 1.27: X10.2 R27.1
N$66
  Top 1.27: X9.2 R26.1
N$67
  Top 0.254: R26.2 39.22,14.61 SJ14.2 | 46.35,12.7 54.61,12.7 R27.2
  Top 1.27: R26.2 SJ10.2 | R27.2 SJ11.1 | SJ14.2 44.45,14.61 46.35,12.7
N$68
  Top 0.254: U$1.15 35.48,42.47 33.02,40.01 33.02,27.3 36.2,24.13 SJ10.1
  Top 1.27: R24.2 SJ10.1
N$69
  Top 0.254: SJ11.2 48.9,17.78 35.56,31.11 35.56,40.64 36.89,41.97 U$1.16
  Top 1.27: R25.2 SJ11.2
N$70  (via drill 1)
  Top 0.254: SJ14.1 42.55,5.08 26.04,5.08 | 26.04,5.08 SJ6.1 | 5.08,33.02 SJ9.1 | 5.08,33.02 5.08,3.17 11.43,3.17 13.34,5.08 26.04,5.08 | 5.08,49.53 SJ3.1 | 5.08,33.02 5.08,49.53 | IC2.3 40.01,62.65 40.01,63.5 | 5.08,49.53 5.08,76.2 24.77,76.2 30.48,70.48 30.48,66.04 37.47,66.04
  Top 0.305: IC2.3 IC2.4 | 40.01,63.5 37.47,63.5 37.47,66.04
  Bottom 1.27: v34.29,37.47 v27.94,37.47 v24.77,40.64 v22.86,42.55 v26.67,46.35 27.3,46.99 v31.75,46.99
  pour Top (isolate 0.6): 62.23,0 -4.45,0 -4.45,79.38 39.37,79.38 38.1,78.11 38.1,65.41 32.38,65.41 32.38,51.44 40.01,45.09 40.01,39.37 62.23,17.14
PD0
  Top 0.254: 76.2,41.36 IC4.30
  Top 0.406: 73.98,25.72 89.22,25.72 | 73.03,34.29 76.2,37.47 76.2,41.36
  Top 0.61: 89.22,25.72 97.79,34.29 97.79,60.01 78.42,79.38
  Top 0.813: JP2.22 75.56,79.38 78.42,79.38
  Top 1.016: 73.98,25.72 73.03,26.67 73.03,34.29
PD1
  Top 0.406: IC4.31 76.93,36.92 74.3,34.29 74.3,32.38 | 74.93,31.75 92.08,31.75
  Top 0.61: 74.93,31.75 74.3,32.38 | 92.08,31.75 96.52,36.2 96.52,58.42
  Top 0.813: JP2.24 77.47,77.47 81.6,73.34 96.52,58.42
PD6
  Top 0.406: IC4.10 76.93,74.2
  Top 1.016: 76.93,74.2 76.83,74.3 | 76.83,74.3 76.83,52.7 | 76.83,74.3 JP2.23
PD7
  Top 0.406: IC4.11 76.13,51.19 75.25,52.07
  Top 1.016: 75.25,52.07 75.25,73.34 JP2.21
SCLK
  Top 0.254: U$1.40 55.63,45.47
  Top 0.305: 55.63,45.47 55.88,45.72
  Top 0.406: 55.88,45.72 58.42,48.26 58.42,48.9 59.05,49.53 60.96,49.53
  Top 0.61: IC4.17 62.49,48.52 JP1.7 60.96,49.53
START
  Top 0.254: U$1.38 55.86,44.47 57.15,43.18 57.15,39.37 58.42,38.1 63.5,38.1 66.67,41.27 71.98,41.27 IC4.25
VSS  (via drill 1)
  Top 0.254: C5.- 60.55,34.67 C2.- 64.11,30.86 C4.- 60.55,26.27 59.05,24.77 | U$1.20 40.93,40.93 41.91,41.91 42.43,41.39 | U$1.23 42.43,41.39 | 42.43,41.39 42.95,41.91 43.18,41.91 43.43,41.66 U$1.25 43.43,41.52 43.81,41.91 46.35,41.91 46.93,41.34 U$1.32 | 43.18,49.53 42.93,49.78 U$1.57 U$1.58 | v43.18,45.72 43.18,49.53 | IC1.6 74.93,10.79 | 74.93,10.79 IC1.3 | C15.- 79.61,10.79 74.93,10.79 | 48.26,72.39 45.72,72.39 41.27,67.94 | R12.1 36.68,58.27 37.47,59.05 37.47,60.96 | U$1.53 44.93,49.53 43.18,49.53 | C9.2 39.37,33.02 40.87,31.52 C11.- 42,31.43 42.23,31.43 | 42.23,31.43 v44.45,29.21 45.09,28.57 48.26,28.57 C12.2 | 42.23,31.43 41.91,31.75
  Top 0.305: 39.37,60.96 IC2.2
  Top 0.406: 37.47,48.9 37.47,50.8
  Top 0.61: IC1.6 IC1.7
  Top 0.813: 40.01,60.96 41.27,62.23 | JP2.9 JP2.11 JP2.14
  Top 1.016: C16.2 41.27,67.94 41.27,62.23 | 37.47,60.96 39.37,60.96 40.01,60.96
  Top 1.27: C6.2 52.3,64.05 C3.- 52.3,68.35 48.26,72.39 JP2.1 | C7.1 R12.1
  Top 1.676: C12.2 50.63,26.07 C1.- 52.74,24.77 59.05,24.77
  Top 2.54: 43.18,41.91 v43.18,45.72
  Bottom 1.016: JP2.1 JP2.4 JP2.5 JP2.8 JP2.9
  other vias: 43.18,71.12 75.56,10.79 60.96,30.48 65.41,24.77 66.67,19.68 68.58,10.79 68.58,4.45
  pour Top (isolate 0.406, rank 2): 86.36,0 86.36,15.24 81.92,20 75.88,20 67.94,27.94 67.94,31.11 62.87,36.2 56.52,36.2 53.34,39.37 49.53,39.37 44.45,44.45 44.45,59.69 47.62,62.87 55.24,62.87 55.24,80.01 38.1,80.01 33.02,74.93 33.02,43.18 39.37,36.83 39.37,31.11 47.62,22.86 55.88,22.86 61.59,17.14 61.59,0
  pour Bottom (isolate 0.406, rank 2): 62.23,80.01 0,80.01 0,60.33 0,0 86.36,0 86.36,20.95 73.03,20.95 73.03,33.02 57.15,33.02 57.15,44.45 45.72,44.45 45.72,53.34 57.78,53.34 57.78,66.04 71.75,66.04 71.75,80.01

### Text on the board
Bottom: (cc) by-nc-sa 2010 | jaseg